# EAGLE design bottom_3-28-21 (EAGLE 9.6.1)
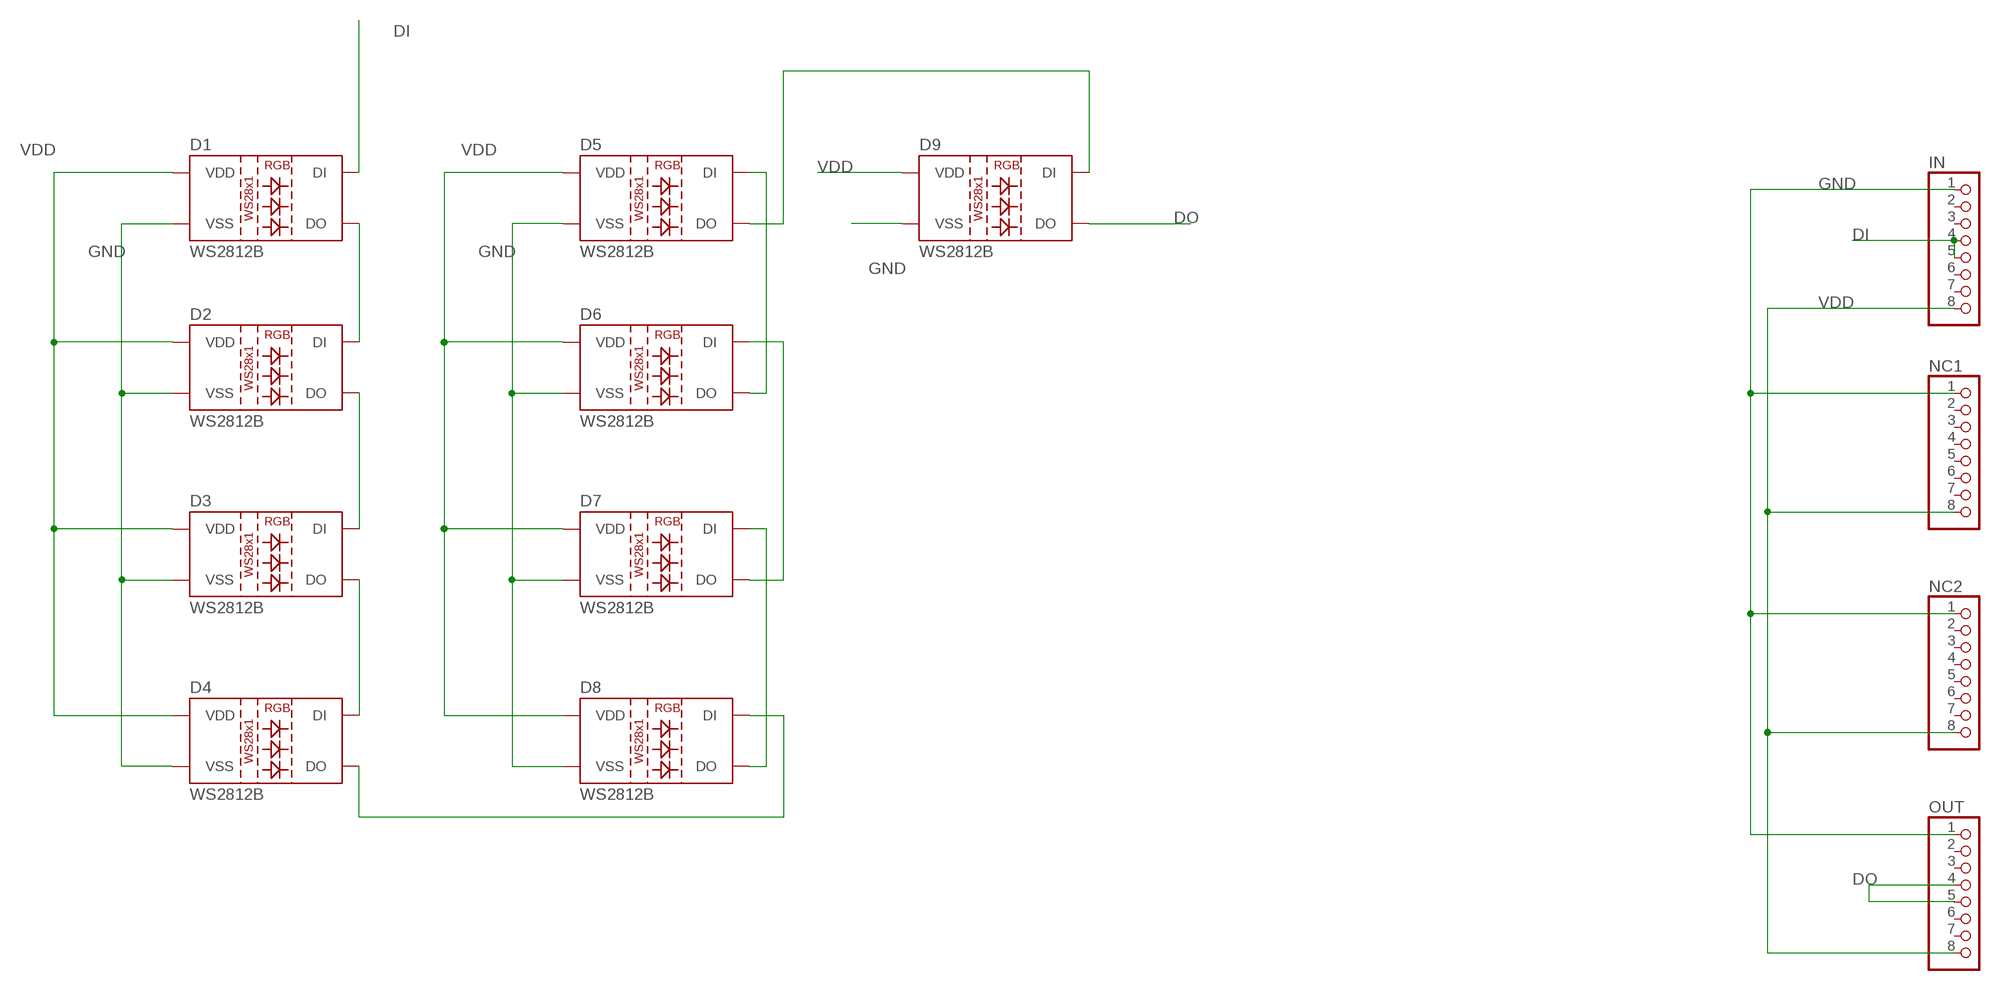
[diagram p0: schematic, sheet 1]

## Parts
D1  WS2812B  [WS2812B]
D2  WS2812B  [WS2812B]
D3  WS2812B  [WS2812B]
D4  WS2812B  [WS2812B]
D5  WS2812B  [WS2812B]
D6  WS2812B  [WS2812B]
D7  WS2812B  [WS2812B]
D8  WS2812B  [WS2812B]
D9  WS2812B  [WS2812B]
IN  PINHD-1X8  [1X08]
NC1  PINHD-1X8  [1X08]
NC2  PINHD-1X8  [1X08]
OUT  PINHD-1X8  [1X08]

## Nets
DI: D1.4(DI) IN.4 IN.5
DO: D9.2(DO) OUT.4 OUT.5
GND: D1.3(VSS) D2.3(VSS) D3.3(VSS) D4.3(VSS) D5.3(VSS) D6.3(VSS) D7.3(VSS) D8.3(VSS) D9.3(VSS) IN.1 NC1.1 NC2.1 OUT.1
N$1: D4.2(DO) D8.4(DI)
N$2: D7.4(DI) D8.2(DO)
N$3: D1.2(DO) D2.4(DI)
N$4: D2.2(DO) D3.4(DI)
N$5: D3.2(DO) D4.4(DI)
N$6: D6.4(DI) D7.2(DO)
N$7: D5.2(DO) D9.4(DI)
N$16: D5.4(DI) D6.2(DO)
VDD [pow_width]: D1.1(VDD) D2.1(VDD) D3.1(VDD) D4.1(VDD) D5.1(VDD) D6.1(VDD) D7.1(VDD) D8.1(VDD) D9.1(VDD) IN.8 NC1.8 NC2.8 OUT.8
Unconnected: IN.2 IN.3 IN.6 IN.7 NC1.2 NC1.3 NC1.4 NC1.5 NC1.6 NC1.7 NC2.2 NC2.3 NC2.4 NC2.5 NC2.6 NC2.7 OUT.2 OUT.3 OUT.6 OUT.7

## Library data of the parts
D1-D9 = my-LED-cube:WS2812B: WS2812B SMD addressable RGB LED 5x5mm SMD LED with built-in controller IC. Color: Red/Green/Blue mC Rating: RGB: 390, 660, 180 mcd Forward Voltage: RGB: 2.0, 3.0, 3.0 V Packages:WS2812B SparkFun Products: Blynk Board - ESP8266 <https://www.sparkfun.com/products/13794>; PROD_ID: DIO-12503
IN NC1 NC2 OUT = pinhead:PINHD-1X8: PIN HEADER

## Net classes
1 pow_width: width 0.102 mm

## Board
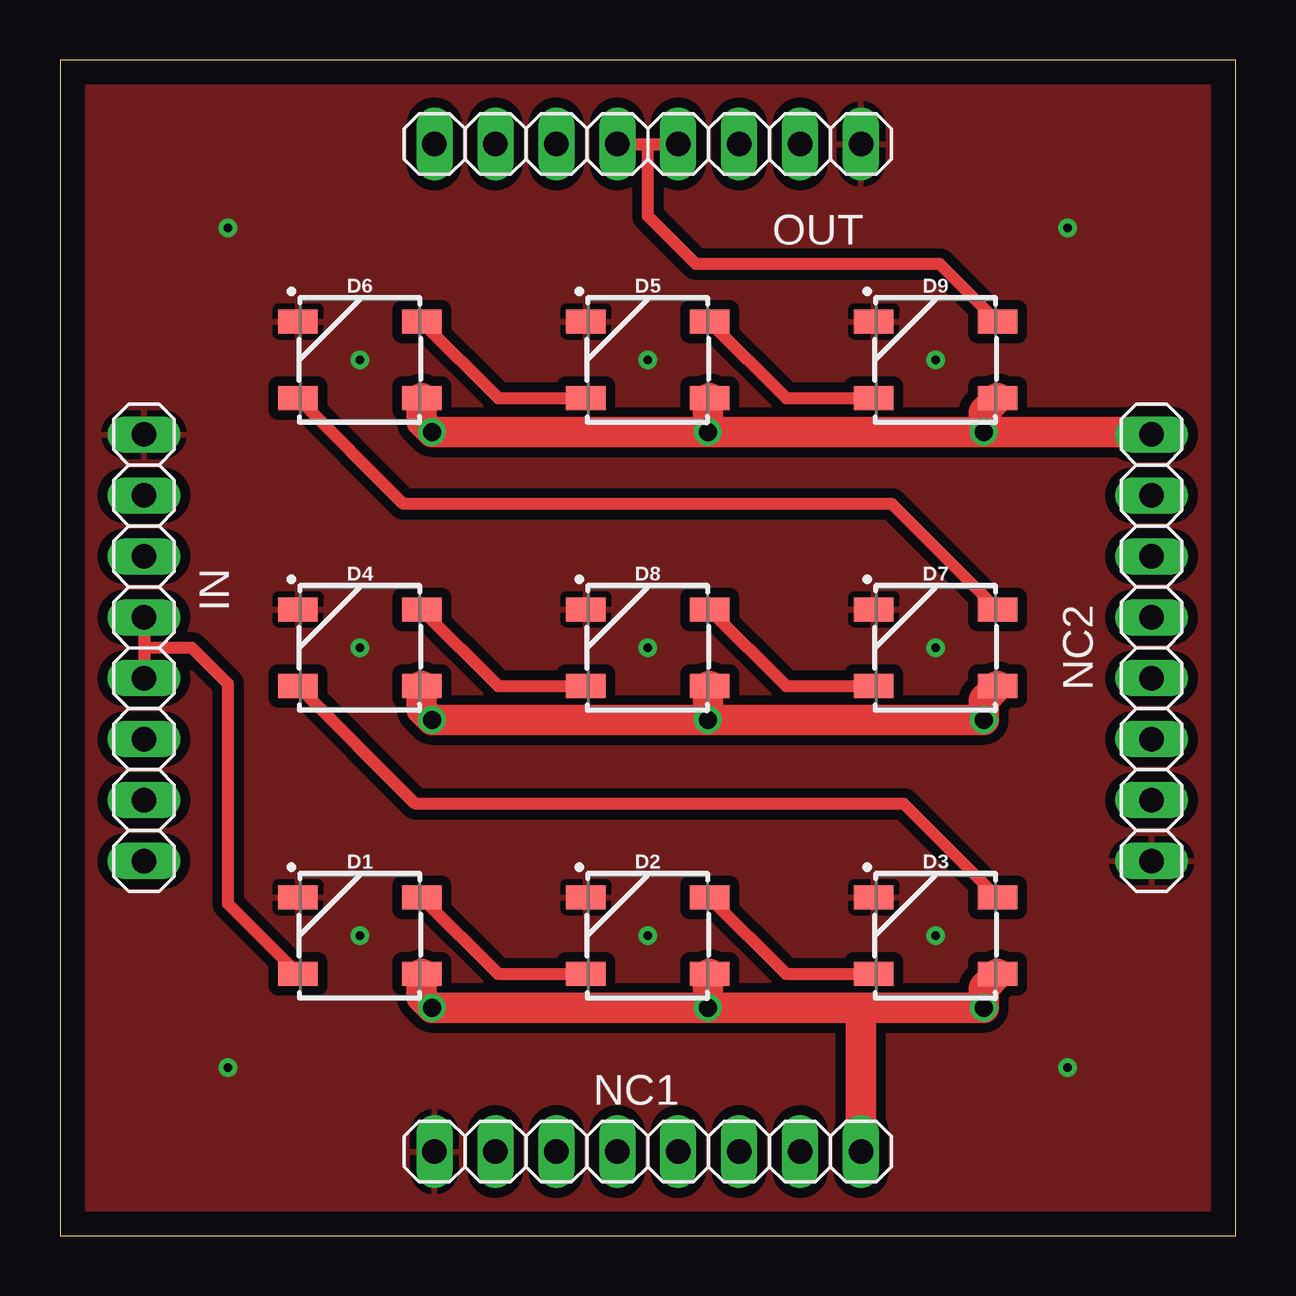
[diagram p1: board, top side]
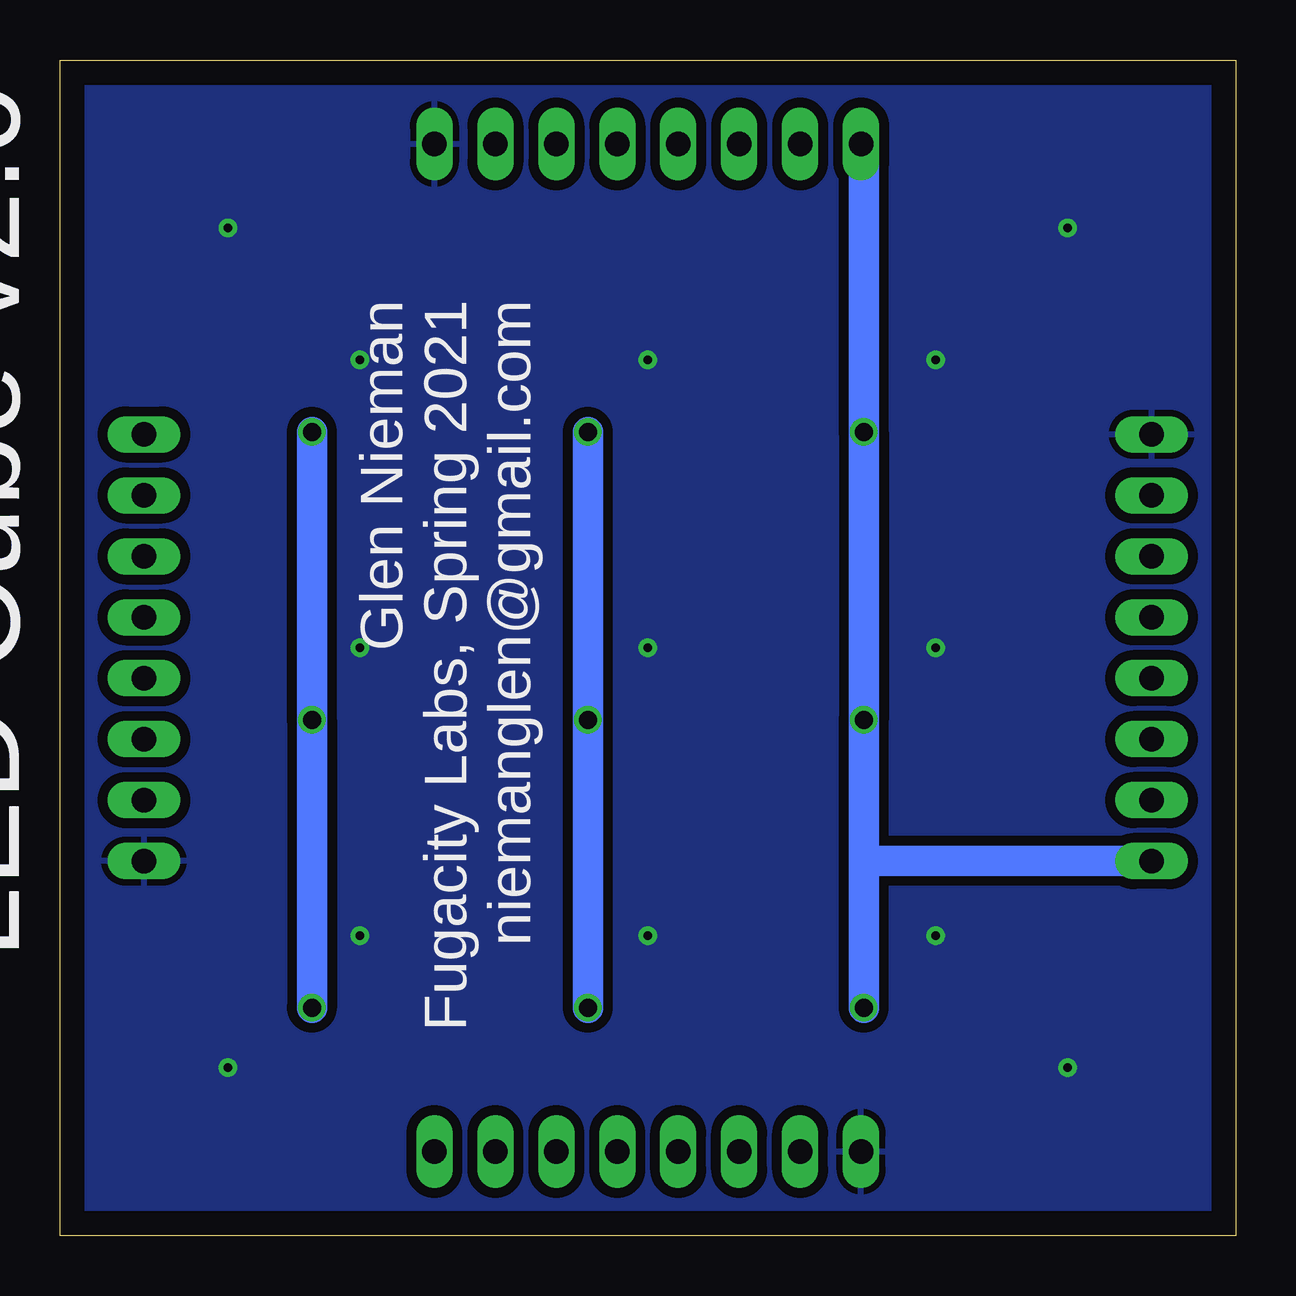
[diagram p2: board, bottom side, seen from below]

Size 49 x 49 mm. Coordinates in mm from the lower left corner, seen from the top.
Outline: 0,0 49,0 49,49 0,49 0,0
Copper layers (1*16): Top 0.035mm / dielectric 1.5mm / Bottom 0.035mm
Design rules "default *": minimum track width 6mil, minimum drill 0.35mm, track to track 6mil, track to pad 6mil, pad to pad 6mil, via to via 6mil, smd to smd 6mil, copper to edge 40mil, drill to drill 6mil, minimum pad ring 10mil, minimum via ring 8mil, stop-mask expansion 4mil, vias tented up to drill 100mil, thermal gap 10mil

### Footprints (pad centres in the part's own frame; a part is rotated, then mirrored left to right if it is on the bottom)
WS2812B = smd 1.651 x 1: 1 2.577,-1.6; 2 2.577,1.6; 3 -2.577,1.6; 4 -2.577,-1.6
1X08 = drill 1.016 long: 1 -8.89,0; 2 -6.35,0; 3 -3.81,0; 4 -1.27,0; 5 1.27,0; 6 3.81,0; 7 6.35,0; 8 8.89,0

### Placement (x,y rotation side)
D1  12.5,12.5 0 top
D2  24.5,12.5 0 top
D3  36.5,12.5 0 top
D4  12.5,24.5 0 top
D5  24.5,36.5 0 top
D6  12.5,36.5 0 top
D7  36.5,24.5 0 top
D8  24.5,24.5 0 top
D9  36.5,36.5 0 top
IN  3.5,24.5 270 top
NC1  24.5,3.5 0 top
NC2  45.5,24.5 90 top
OUT  24.5,45.5 180 top

### Tracks (layer width: path | path; a pad name or v marks a point on that pad's centre or on a via)
DI
  Top 0.508: D1.4 7,13.82 7,23 5.5,24.5 3.5,24.5 | IN.4 3.5,24.5 | 3.5,24.5 IN.5
DO
  Top 0.508: D9.2 36.68,40.5 26.5,40.5 24.5,42.5 24.5,45.5 | OUT.5 24.5,45.5 | 24.5,45.5 OUT.4
GND  (via drill 0.35)
  other vias: 7,7 42,7 42,42 7,42 12.5,36.5 24.5,36.5 36.5,36.5 12.5,24.5 24.5,24.5 36.5,24.5 36.5,12.5 24.5,12.5 12.5,12.5
  pour Top (isolate 0.406): 0,0 0,49 49,49 49,0
  pour Bottom (isolate 0.406): 0,0 0,49 49,49 49,0
N$1
  Top 0.508: D4.2 18.28,22.9 D8.4
N$2
  Top 0.508: D8.2 30.28,22.9 D7.4
N$3
  Top 0.508: D1.2 18.28,10.9 D2.4
N$4
  Top 0.508: D2.2 30.28,10.9 D3.4
N$5
  Top 0.508: D3.2 35.18,18 14.82,18 D4.4
N$6
  Top 0.508: D7.2 34.68,30.5 14.32,30.5 D6.4
N$7
  Top 0.508: D5.2 30.28,34.9 D9.4
N$16
  Top 0.508: D6.2 18.28,34.9 D5.4
VDD  (via drill 0.75)
  Top 1.27: D1.1 15.08,9.92 v15.5,9.5 v27,9.5 | v27,9.5 27,10.82 D2.1 | D3.1 38.5,10.32 v38.5,9.5 33.5,9.5 | D4.1 15.08,21.92 v15.5,21.5 v27,21.5 | v27,21.5 27,22.82 D8.1 | D7.1 38.5,22.32 v38.5,21.5 v27,21.5 | D6.1 15.08,33.92 v15.5,33.5 v27,33.5 | v27,33.5 27,34.82 D5.1 | v38.5,33.5 38.5,34.32 D9.1 | v27,33.5 v38.5,33.5 | v27,9.5 33.5,9.5 | v38.5,33.5 45.39,33.5 NC2.8 | NC1.8 33.39,9.39 33.5,9.5
  Bottom 1.27: v15.5,9.5 15.5,15.5 | 15.5,15.5 v15.5,21.5 v15.5,33.5 15.5,45.39 OUT.8 | v38.5,33.5 v38.5,21.5 v38.5,9.5 | v27,9.5 v27,21.5 v27,33.5 | IN.8 15.39,15.61 15.5,15.5

### Text on the board
bPlace: LED Cube v2.0 | Glen Nieman / Fugacity Labs, Spring 2021 / niemanglen@gmail.com